# Altium schematic sheet peripherals.SchDoc
size Legal
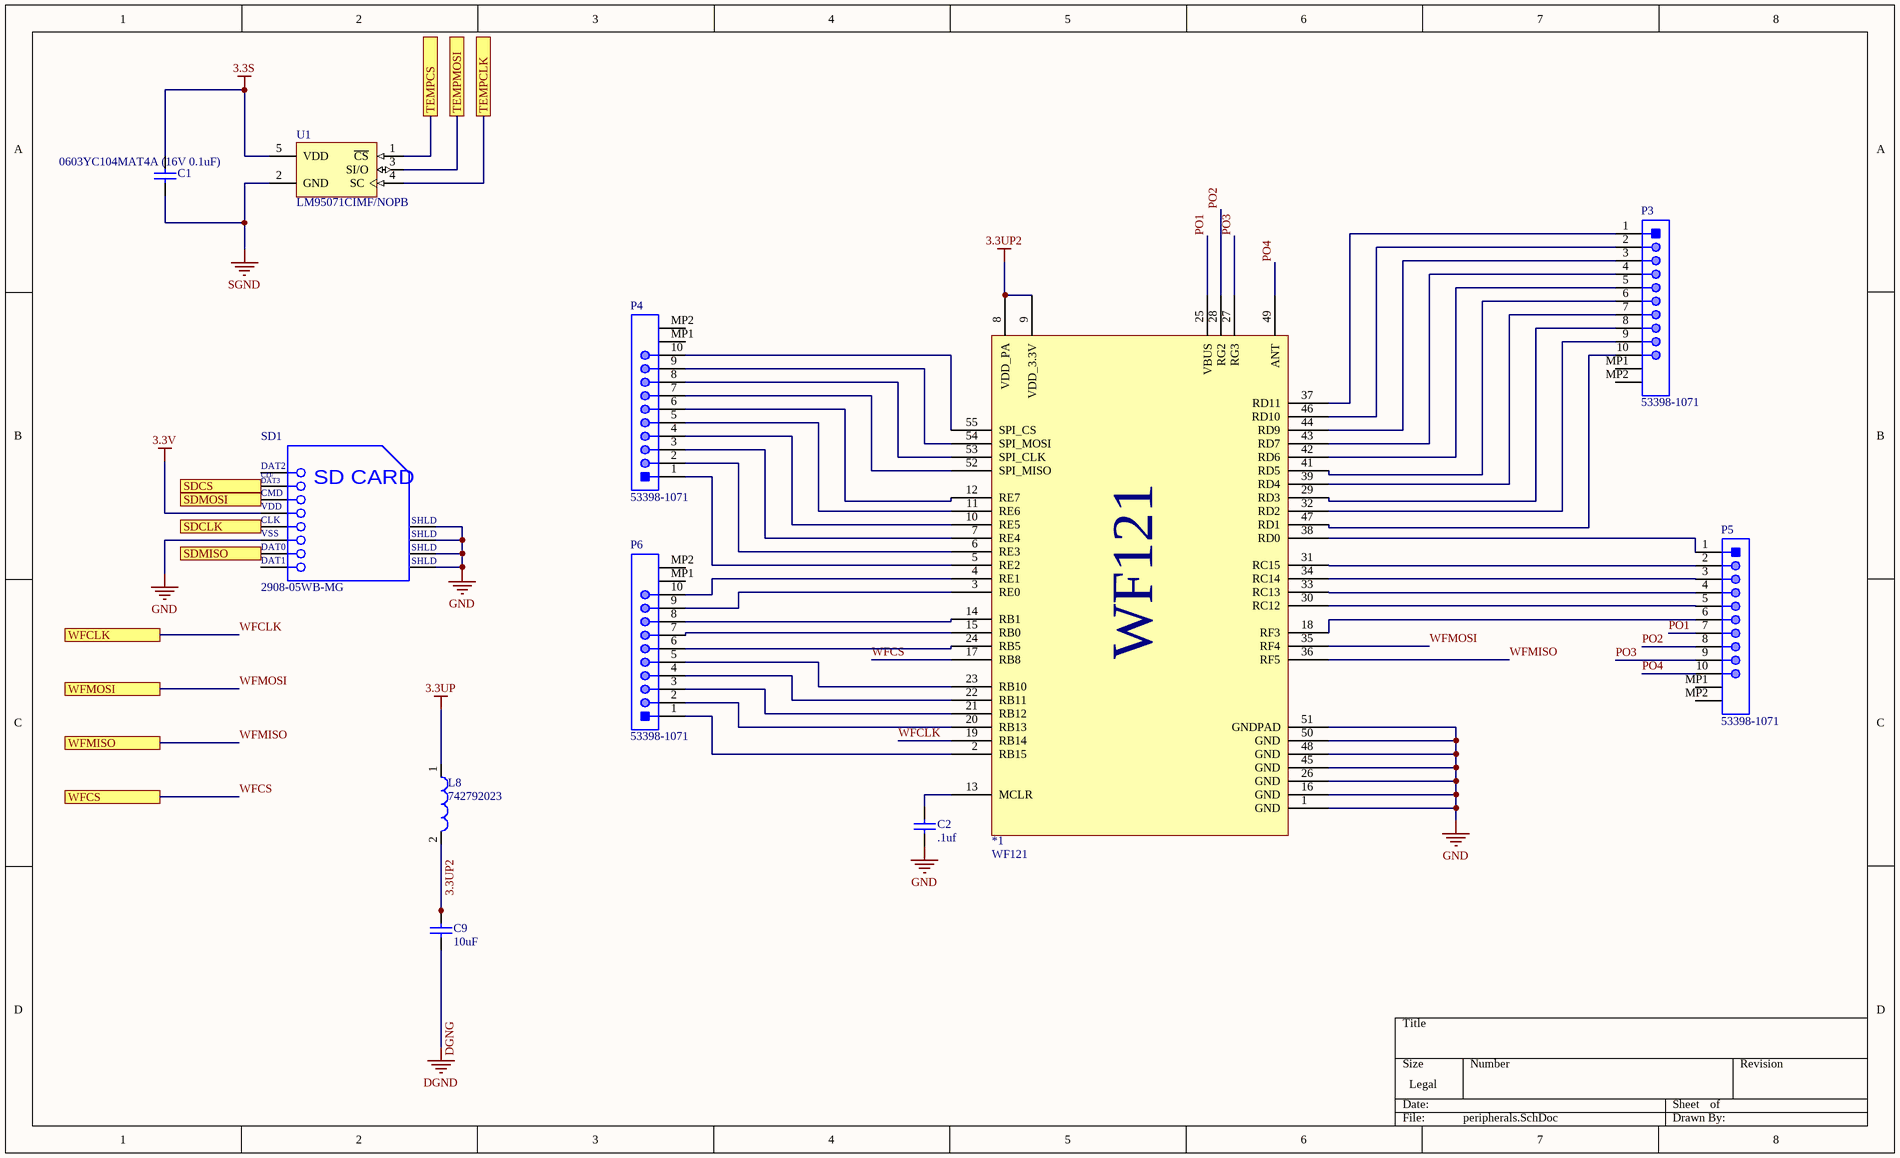
[diagram p0: peripherals.SchDoc]

## Parts
*1  WF121  [WF121]
C1  0603YC104MAT4A (16V 0.1uF)  [CAPC1608X90X35LL15T15]
C2  .1uf  [CAPC2013X94X50NL20T25]
C9  10uF  [CAPC1608X90X35NL10T15]
L8  742792023  [SMD-0805]
P3  53398-1071  [MOLX-53398-1071_V]
P4  53398-1071  [MOLX-53398-1071_V]
P5  53398-1071  [MOLX-53398-1071_V]
P6  53398-1071  [MOLX-53398-1071_V]
SD1  2908-05WB-MG  [3M-2908-05WB-MG_V]
U1  LM95071CIMF/NOPB  [DBV0005A_L]

## Ports
SDCLK, SDCS, SDMISO, SDMOSI, TEMPCLK, TEMPCS, TEMPMOSI, WFCLK, WFCS, WFMISO, WFMOSI

## Nets
3.3S: C1.2 U1.5(VDD)
3.3UP: L8.1
3.3UP2: *1.8(VDD_PA) *1.9(VDD_3.3V) C9.2 L8.2
3.3V: SD1.4(VDD)
DGNG: C9.1  [also labelled DGND]
GND: *1.1(GND) *1.16(GND) *1.26(GND) *1.45(GND) *1.48(GND) *1.50(GND) *1.51(GNDPAD) C2.1 SD1.6(VSS) SD1.9(SHLD) SD1.10(SHLD) SD1.11(SHLD) SD1.12(SHLD)
SGND: C1.1 U1.2(GND)
PO1: *1.25(VBUS) P5.7
PO2: *1.28(RG2) P5.8
PO3: *1.27(RG3) P5.9
PO4: *1.49(ANT) P5.10
SDCLK: SD1.5(CLK) ; port SDCLK
SDCS: SD1.2(CD/DAT3) ; port SDCS
SDMISO: SD1.7(DAT0) ; port SDMISO
SDMOSI: SD1.3(CMD) ; port SDMOSI
TEMPCLK: U1.4(SC) ; port TEMPCLK
TEMPCS: U1.1(~{CS}) ; port TEMPCS
TEMPMOSI: U1.3(SI/O) ; port TEMPMOSI
WFCLK: *1.19(RB14) ; port WFCLK
WFCS: *1.17(RB8) ; port WFCS
WFMISO: *1.36(RF5) ; port WFMISO
WFMOSI: *1.35(RF4) ; port WFMOSI
Net*1_2: *1.2(RB15) P6.1
Net*1_3: *1.3(RE0) P6.9
Net*1_4: *1.4(RE1) P6.10
Net*1_5: *1.5(RE2) P4.1
Net*1_6: *1.6(RE3) P4.2
Net*1_7: *1.7(RE4) P4.3
Net*1_10: *1.10(RE5) P4.4
Net*1_11: *1.11(RE6) P4.5
Net*1_12: *1.12(RE7) P4.6
Net*1_13: *1.13(MCLR) C2.2
Net*1_14: *1.14(RB1) P6.8
Net*1_15: *1.15(RB0) P6.7
Net*1_18: *1.18(RF3) P5.6
Net*1_20: *1.20(RB13) P6.2
Net*1_21: *1.21(RB12) P6.3
Net*1_22: *1.22(RB11) P6.4
Net*1_23: *1.23(RB10) P6.5
Net*1_24: *1.24(RB5) P6.6
Net*1_29: *1.29(RD3) P3.8
Net*1_30: *1.30(RC12) P5.5
Net*1_31: *1.31(RC15) P5.2
Net*1_32: *1.32(RD2) P3.9
Net*1_33: *1.33(RC13) P5.4
Net*1_34: *1.34(RC14) P5.3
Net*1_37: *1.37(RD11) P3.1
Net*1_38: *1.38(RD0) P5.1
Net*1_39: *1.39(RD4) P3.7
Net*1_41: *1.41(RD5) P3.6
Net*1_42: *1.42(RD6) P3.5
Net*1_43: *1.43(RD7) P3.4
Net*1_44: *1.44(RD9) P3.3
Net*1_46: *1.46(RD10) P3.2
Net*1_47: *1.47(RD1) P3.10
Net*1_52: *1.52(SPI_MISO) P4.7
Net*1_53: *1.53(SPI_CLK) P4.8
Net*1_54: *1.54(SPI_MOSI) P4.9
Net*1_55: *1.55(SPI_CS) P4.10

Not connected (* = marked no-connect by the designer): P3 MP1 MP2; P4 MP1 MP2; P5 MP1 MP2; P6 MP1 MP2; SD1 1(DAT2) 8(DAT1)

## Notes on the sheet
- (in symbol CMP-2000-05030-1) CD/; DAT3; SD CARD

## Library data of the parts
*1 = WF121: WF121 WIFI Module.; ComponentLink1Description: Datasheet; ComponentLink1URL: https://www.silabs.com/documents/public/data-sheets/WF121-DataSheet.pdf
C1 = CMP-2006-02126-1: Manufacturer: AVX Interconnect / Elco; Part Number: 0603YC104MAT4A
C2 = CMP-2007-04454-1: Part Number: 0805YC104KAT2A; Manufacturer: AVX Interconnect / Elco
C9 = CMP-2006-02792-1: Part Number: GRM188R60J106ME47D; Manufacturer: Murata
L8 = CMP-0220-00030-1: SMD EMI Suppression Ferrite Bead WE-CBF, Z = 120 Ohm; Impedance: 120 Ohm; PackageDescription: Chip Inductor, 2-Leads, Body 2.0 x 1.2 mm; ComponentLink2URL: http://www.we-online.de/katalog/media/pdf/742792023.pdf; ComponentLink1Description: Manufacturer Link; ComponentLink2Description: Datasheet; DatasheetVersion: Dec-2005; PackageReference: SMD-0805; ComponentLink1URL: http://www.we-online.com; PackageVersion: 2005
P3-P6 = CMP-2000-05635-1: Male Header, Pitch 1.25 mm, 1 x 10 Position, Height 4.7 mm, -40 to 85 degC, RoHS, Tape and Reel; Manufacturer: Molex; Mounting Angle: Vertical; Pitch: 1.25mm; Voltage Rating: 125V; Current Rating: 1A; Number of Rows: 1Row; Housing Material: Nylon; Mounting Technology: SurfaceMount; Mounting Style: SMD; Contact Material: PhosphorBronze; Product: Headers; Datasheet URL: http://www.molex.com/pdm_docs/sd/533981071_sd.pdf; Manufacturer URL: http://www.molex.com/; Datasheet Version: Rev. J, 09/2015; Factory Pack Quantity: 1000; Brand: Molex; Packaging: Reel; Product Category: Headers&WireHousings; Contact Gender: Pin(Male); Number of Positions: 10Position; RoHS: Details; Contact Plating: Tin; Package Description: Male Header, Pitch 1.25 mm, 1 x 10 Position, Height 4.7 mm; Series: 53398; Type: Shrouded; Package Reference: 53398-1071; Tradename: PicoBlade; Termination Style: SMD
SD1 = CMP-2000-05030-1: Card Connector Micro-SD, 500 VAC, 100 mOhm Min, 0.5 A, RoHS, Tape and Reel; Manufacturer: 3M; Connector Type: ConnectorandEjector; Other Related Documents: SDCardDateCodeDecipher; Insertion, Removal Method: PushIn,PushOut; Other Names: 3M5607CT; PCN Obsolescence/ EOL: 2908Series30/Jun/2010; Number of Positions: 10(8+2); Card Type: SecureDigital-microSD™; Online Catalog: 2900Series; Featured Product: 3MCardConnectormicroSD; Features: Switch; Packaging: CutTape(CT); Package Reference: 2908-05WB-MG; Package Description: 8-Pin Surface Mount Device, Body 15.2 x 14 mm, Pitch 1.1 mm; Contact Finish: Gold; Catalog Drawings: 2908-05WB-MG; Mounting Feature: Normal,Standard-Top; Series: 2900; Datasheet Version: Oct-06; Datasheet URL: http://datasheet.octopart.com/2908-05WB-MG-3M-datasheet-6398107.pdf; Contact Finish Thickness: 15µin(0.38µm); Manufacturer URL: http://www.3m.com/; Family: MemoryConnectors-PCCardSockets; Category: Connectors,Interconnects; Standard Package: 1; Mounting Type: SurfaceMount,RightAngle; Ejector Side: -; Height Above Board: 0.073"(1.85mm)
U1 = CMP-0066-00211-3: SPI/MICROWIRE 13-Bit Plus Sign Temperature Sensor, 5-pin SOT-23, Pb-Free; Manufacturer: Texas Instruments; CompType: Temp Sensor IC; PackageTopMarking: T18C*XTT; PowerWise: Y; PackageDescription: Molded SOT-23, .115 x .063 x .040 in Body, 5 Lead, .0375 in Pitch; ComponentLink1URL: http://www.ti.com/general/docs/lit/getliterature.tsp?genericPartNumber=LM95071&fileType=pdf; ComponentLink1Description: Datasheet URL; PinCount: 5; RoHS: Y; PackageReference: DBV0005A